# EAGLE design CV_LEDControl (EAGLE 9.5.2)
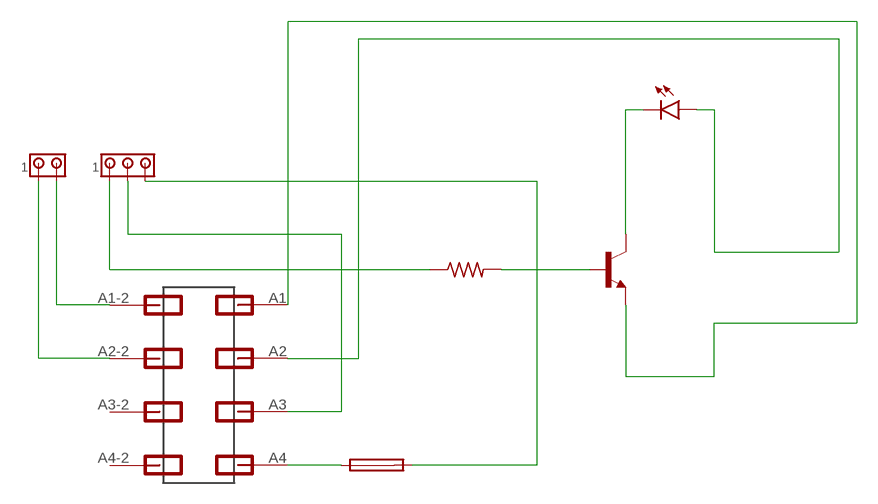
[diagram p0: schematic, sheet 1]

## Parts
E1  WEIDMUELLER_1824440000WEIDMUELLER_1824440000_0_0  [WEIDMUELLER_1824440000_0]
F1  SH22,5  [SH22,5]
J1  MTA03-100  [10X03MTA]
J2  MTA02-100  [10X02MTA]
LED1  LED3MM  [LED3MM]
R1  R-US_0204/7  [0204/7]
T1  2N2102  [TO5]

## Nets
N$1: R1.2 T1.2(B)
N$2: J1.1 R1.1
N$3: E1.A4(A3) F1.1
N$4: LED1.K(C) T1.3(C)
N$5: E1.A2(A1) LED1.A
N$6: F1.2 J1.3
N$7: E1.A3(A2) J1.2
N$8: E1.A2-2(A6) J2.1
N$9: E1.A1-2(A5) J2.2
N$10: E1.A1(A4) T1.1(E)
Unconnected: E1.A3-2(A7) E1.A4-2(A8)

## Library data of the parts
E1 = Weidmueller - 1824440000:WEIDMUELLER_1824440000: Terminal_04_1x04_Single; CIIVA_IDS: 21179559; COLOUR: Black; COMPONENT_LINK_1_DESCRIPTION: Manufacturer URL; COMPONENT_LINK_1_URL: http://www.weidmueller.com/; COMPONENT_LINK_2_DESCRIPTION: URL Link1; COMPONENT_LINK_2_URL: http://catalog.weidmueller.com/catalog/Start.do?localeId=en&ObjectID=1824440000; CONTACT_MATERIAL: Cu-Leg; CONTACT_SURFACE: tinned; FOOTPRINT_VARIANT_NAME_0: Manufacturer Recommended; IMPORTED: yes; IMPORTED_FROM: vault; IMPORT_TS: 1521860254; INSULATING_MATERIAL: LCP GF; MF: Weidmueller; MOUNTING_ONTO_THE__PCB: Reflow solder connection; MPN: 1824440000; NO_OF_POLES: 4; PACKAGE: LSF_SMT_3_5_90_04; PACKAGING: Tube; PITCH_INCH: 0,138 inch; PITCH_MM: 3,5 mm; PREFIX: E; QTY: 37 PCS; RATED_CURRENT_MIN_NO_OF_POLES__TU__20_DEG__C: 19 A; RATED_CURRENT_USE_GROUP__B__UL__1059: 12 A; RATED_VOLTAGE_FOR_SURGE_VOLTAGE_CLASS_POLLUTION_DEGREE__II__2: 320 V; RATED_VOLTAGE_USE_GROUP__B__UL__1059: 300 V; RELEASE_DATE: 1441960110; REVISION: V1; SHORT_TEXT_FOR_MATERIAL: LSF-SMT 3.50/04/90 3.5SN BK TU; SIDE_TERMINATION_CHARACTERISTIC: closed side; SOLDER_PIN_LENGTH_MM: 3,5 mm; SOLID_MAX__H_05__07__V__U: 1,5 mm2; SOLID_MIN__H_05__07__V__U: 0,2 mm2; UL__94_FLAMMABILITY_RATING: V-0; VAULT_GUID: CD4E20E1-AA6F-4BB5-BEF7-F6E0E90FC9A2; VAULT_REVISION: E4DF01BF-3ED4-43ED-8DAE-3D021E4ED478; WIRE_CROSS_SECTION__AWG_MAX__UL__1059: AWG 16; WIRE_CROSS_SECTION__AWG_MIN__UL__1059: AWG 24
F1 = fuse:SH22,5: FUSE HOLDER grid 22,5 mm, OGN0031 8201, Schurter (Buerklin); MF: SCHURTER; MPN: 0031.8201; OC_FARNELL: 1162740; OC_NEWARK: 96F8317
J1 = con-amp:MTA03-100: AMP connector; SPICEPREFIX: X
J2 = con-amp:MTA02-100: AMP connector; SPICEPREFIX: B
LED1 = led:LED: LED OSRAM: - CHIPLED LG R971, LG N971, LY N971, LG Q971, LY Q971, LO R971, LY R971 LH N974, LH R974 LS Q976, LO Q976, LY Q976 LO Q996 - Hyper CHIPLED LW Q18S LB Q993, LB Q99A, LB R99A - SideLED LS A670, LO A670, LY A670, LG A670, LP A670 LB A673, LV A673, LT A673, LW A673 LH A674 LY A675 LS A676, LA A676, LO A676, LY A676, LW A676 LS A679, LY A679, LG A679 - Hyper Micro SIDELED® LS Y876, LA Y876, LO Y876, LY Y876 LT Y87S - SmartLED LW L88C, LW L88S LB L89C, LB L89S, LG L890 LS L89K, LO L89K, LY L89K LS L896, LA L896, LO L896, LY L896 - TOPLED LS T670, LO T670, LY T670, LG T670, LP T670 LSG T670, LSP T670, LSY T670, LOP T670, LYG T670 LG T671, LOG T671, LSG T671 LB T673, LV T673, LT T673, LW T673 LH T674 LS T676, LA T676, LO T676, LY T676, LB T676, LH T676, LSB T676, LW T676 LB T67C, LV T67C, LT T67C, LS T67K, LO T67K, LY T67K, LW E67C LS E67B, LA E67B, LO E67B, LY E67B, LB E67C, LV E67C, LT E67C LW T67C LS T679, LY T679, LG T679 LS T770, LO T770, LY T770, LG T770, LP T770 LB T773, LV T773, LT T773, LW T773 LH T774 LS E675, LA E675, LY E675, LS T675 LS T776, LA T776, LO T776, LY T776, LB T776 LHGB T686 LT T68C, LB T68C - Hyper Mini TOPLED® LB M676 - Mini TOPLED Santana® LG M470 LS M47K, LO M47K, LY M47K Source: http://www.osram.convergy.de LUXEON: - LUMILED® LXK2-PW12-R00, LXK2-PW12-S00, LXK2-PW14-U00, LXK2-PW14-V00 LXK2-PM12-R00, LXK2-PM12-S00, LXK2-PM14-U00 LXK2-PE12-Q00, LXK2-PE12-R00, LXK2-PE12-S00, LXK2-PE14-T00, LXK2-PE14-U00 LXK2-PB12-K00, LXK2-PB12-L00, LXK2-PB12-M00, LXK2-PB14-N00, LXK2-PB14-P00, LXK2-PB14-Q00 LXK2-PR12-L00, LXK2-PR12-M00, LXK2-PR14-Q00, LXK2-PR14-R00 LXK2-PD12-Q00, LXK2-PD12-R00, LXK2-PD12-S00 LXK2-PH12-R00, LXK2-PH12-S00 LXK2-PL12-P00, LXK2-PL12-Q00, LXK2-PL12-R00 Source: www.luxeon.com KINGBRIGHT: KA-3528ASYC Source: www.kingbright.com
R1 = rcl:R-US_: RESISTOR, American symbol; SPICEPREFIX: R
T1 = transistor-neu-to92:2N2102: NPN TRANSISTOR

## Board
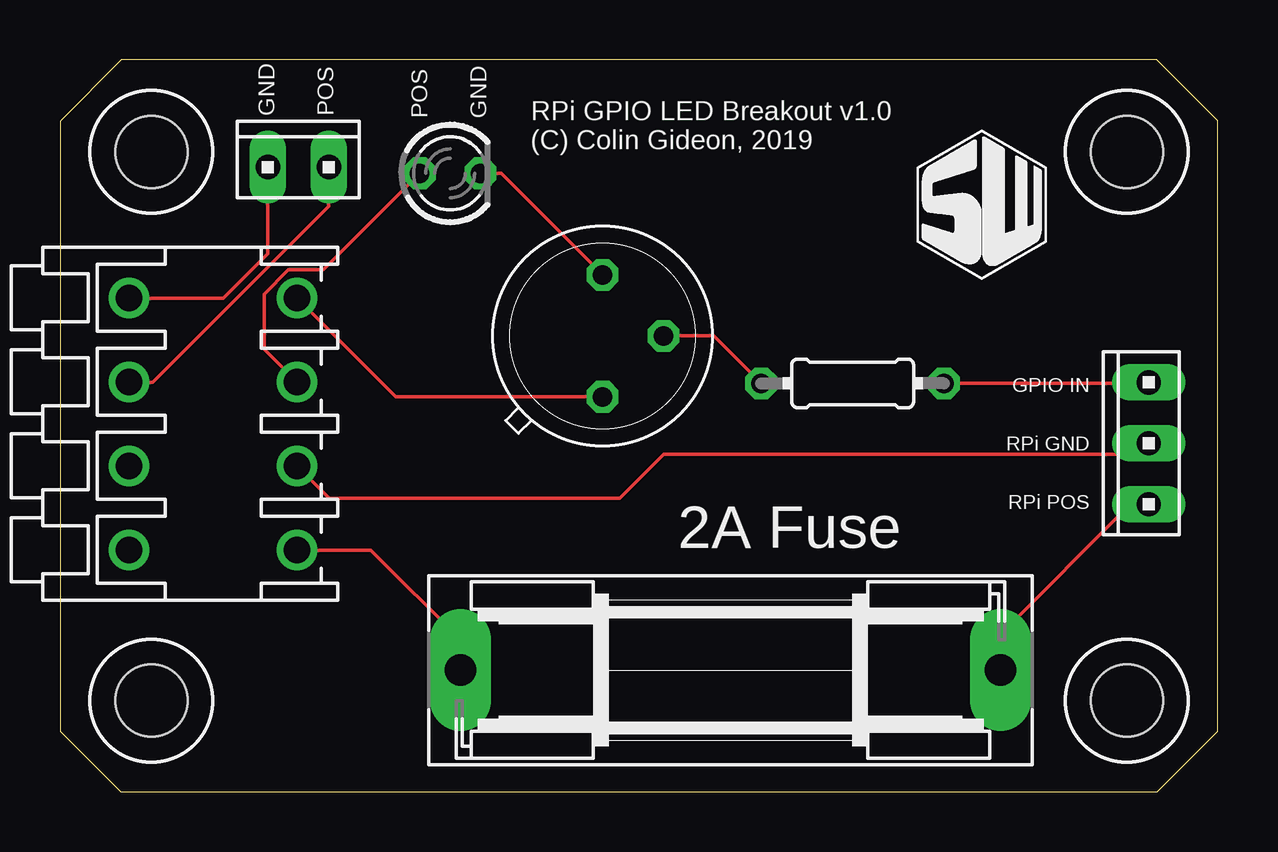
[diagram p1: board, top side]
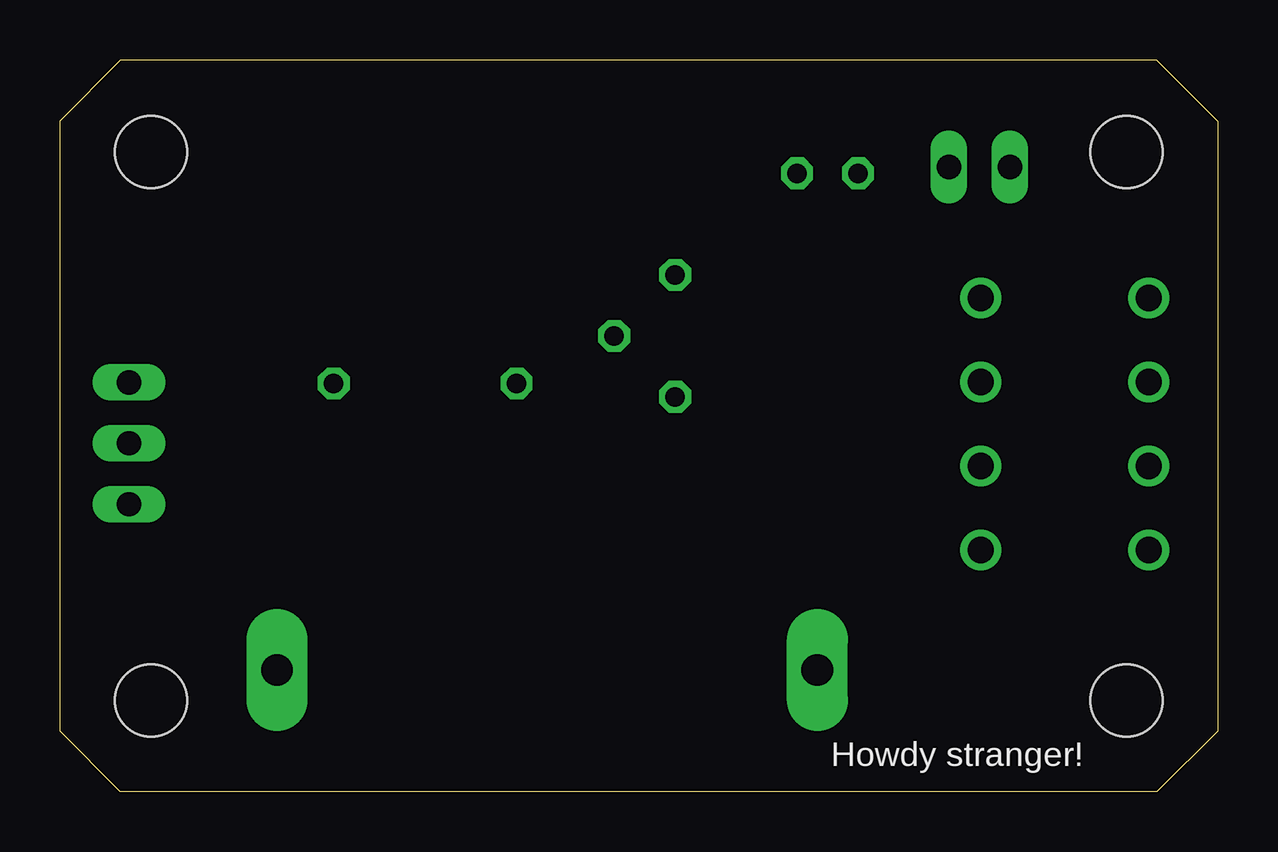
[diagram p2: board, bottom side, seen from below]

Size 48.24 x 30.5 mm. Coordinates in mm from the lower left corner, seen from the top.
Outline: 2.54,0 45.72,0 48.24,2.52 48.24,27.96 45.7,30.5 2.56,30.5 0,27.94 0,2.54 2.54,0
Copper layers (1*16): Top 0.035mm / dielectric 1.5mm / Bottom 0.035mm
Design rules "default": minimum track width 6mil, minimum drill 0.35mm, track to track 6mil, track to pad 6mil, pad to pad 6mil, via to via 6mil, smd to smd 6mil, copper to edge 40mil, drill to drill 6mil, minimum pad ring 10mil, minimum via ring 8mil, stop-mask expansion 4mil, vias tented up to drill 0mil, thermal gap 10mil
Holes 3 mm at 3.81,3.81 44.45,3.81 44.45,26.67 3.81,26.67

### Footprints (pad centres in the part's own frame; a part is rotated, then mirrored left to right if it is on the bottom)
WEIDMUELLER_1824440000_0 = drill 1.1 pad 1.7: A1 -5.24,5.1; A1-2 -5.24,-1.9; A2 -1.74,5.1; A2-2 -1.74,-1.9; A3 1.76,5.1; A3-2 1.76,-1.9; A4 5.26,5.1; A4-2 5.26,-1.9
SH22,5 = drill 1.321 pad 2.54 long: 1 -11.252,0; 2 11.252,0
10X03MTA = drill 1.016 long: 1 2.54,0; 2 0,0; 3 -2.54,0
10X02MTA = drill 1.016 long: 1 1.27,0; 2 -1.27,0
LED3MM = drill 0.813 octagon: A -1.27,0; K 1.27,0
0204/7 = drill 0.813 octagon: 1 -3.81,0; 2 3.81,0
TO5 = drill 0.813 octagon: 1 0,-2.54; 2 2.54,0; 3 0,2.54

### Placement (x,y rotation side)
E1  4.78,15.34 270 top
F1  27.94,5.08 0 top
J1  45.36,14.53 90 top
J2  9.93,26.04 0 top
LED1  16.26,25.78 0 top
R1  33.03,17.02 180 top
T1  22.61,19 0 top

### Tracks (layer width: path | path; a pad name or v marks a point on that pad's centre or on a via)
N$1
  Top 0.152: R1.2 27.23,19 T1.2
N$2
  Top 0.152: R1.1 45.32,17.02 J1.1
N$3
  Top 0.152: F1.1 16.69,6.35 12.96,10.08 E1.A4
N$4
  Top 0.152: T1.3 18.38,25.78 LED1.K
N$5
  Top 0.152: LED1.A 10.96,21.75 9.52,21.75 8.51,20.74 8.51,18.45 E1.A2
N$6
  Top 0.152: J1.3 44.6,11.99 39.19,6.58 39.19,6.35 F1.2
N$7
  Top 0.152: E1.A3 11.22,12.23 23.32,12.23 25.15,14.07 29.21,14.07 29.65,14.07 44.9,14.07 J1.2
N$8
  Top 0.152: J2.1 11.2,24.41 3.87,17.08 E1.A2-2
N$9
  Top 0.152: J2.2 8.66,22.43 6.81,20.58 E1.A1-2
N$10
  Top 0.152: T1.1 13.99,16.46 E1.A1

### Text on the board
tPlace: GND / POS | POS / GND | RPi GPIO LED Breakout v1.0 / (C) Colin Gideon, 2019 | GPIO IN / / RPi GND / / RPi POS | 2A Fuse
bPlace: Howdy stranger!